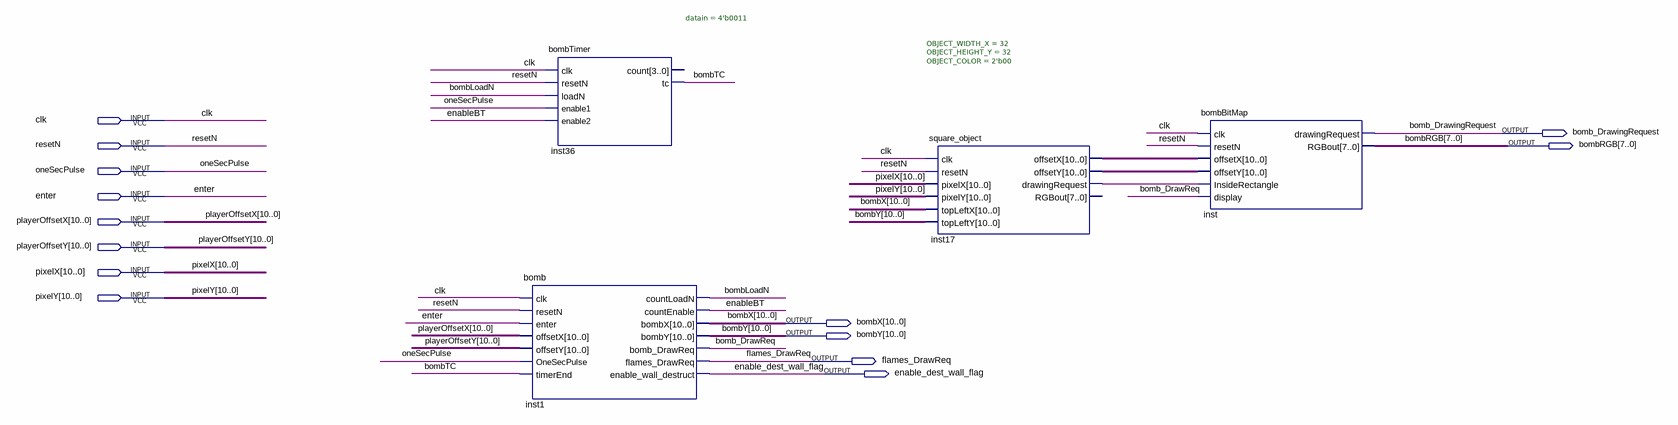
[diagram p0: schematic sheet]
// Quartus schematic BOMB_DISPLAY.bdf as structural Verilog: 4 symbols, 14 pins
module BOMB_DISPLAY (
  input  clk,
  input  resetN,
  input  oneSecPulse,
  input  enter,
  input  [10:0] playerOffsetX,
  input  [10:0] playerOffsetY,
  input  [10:0] pixelX,
  input  [10:0] pixelY,
  output bomb_DrawingRequest,
  output [7:0] bombRGB,
  output [10:0] bombX,
  output [10:0] bombY,
  output flames_DrawReq,
  output enable_dest_wall_flag
);

  wire bomb_DrawReq, bombLoadN, bombTC, enableBT, inst17_drawingrequest;
  wire [10:0] inst17_offsetx, inst17_offsety;

  bomb inst1 (
    .clk(clk), .resetN(resetN), .enter(enter), .offsetX(playerOffsetX), .offsetY(playerOffsetY),
    .OneSecPulse(oneSecPulse), .timerEnd(bombTC), .countLoadN(bombLoadN), .countEnable(enableBT),
    .bombX(bombX), .bombY(bombY), .bomb_DrawReq(bomb_DrawReq), .flames_DrawReq(flames_DrawReq),
    .enable_wall_destruct(enable_dest_wall_flag));
  bombTimer #(.datain(4'b0011)) inst36 (
    .clk(clk), .resetN(resetN), .loadN(bombLoadN), .enable1(oneSecPulse), .enable2(enableBT), .tc(bombTC));  // open: count
  square_object #(.OBJECT_WIDTH_X(32), .OBJECT_HEIGHT_Y(32), .OBJECT_COLOR(2'b00)) inst17 (
    .clk(clk), .resetN(resetN), .pixelX(pixelX), .pixelY(pixelY), .topLeftX(bombX), .topLeftY(bombY),
    .offsetX(inst17_offsetx), .offsetY(inst17_offsety), .drawingRequest(inst17_drawingrequest));  // open: RGBout
  bombBitMap inst (
    .clk(clk), .resetN(resetN), .offsetX(inst17_offsetx), .offsetY(inst17_offsety),
    .InsideRectangle(inst17_drawingrequest), .display(bomb_DrawReq), .drawingRequest(bomb_DrawingRequest),
    .RGBout(bombRGB));
endmodule
